# EAGLE schematic FDL-1 BSTP v1.0 (EAGLE 7.5.0)
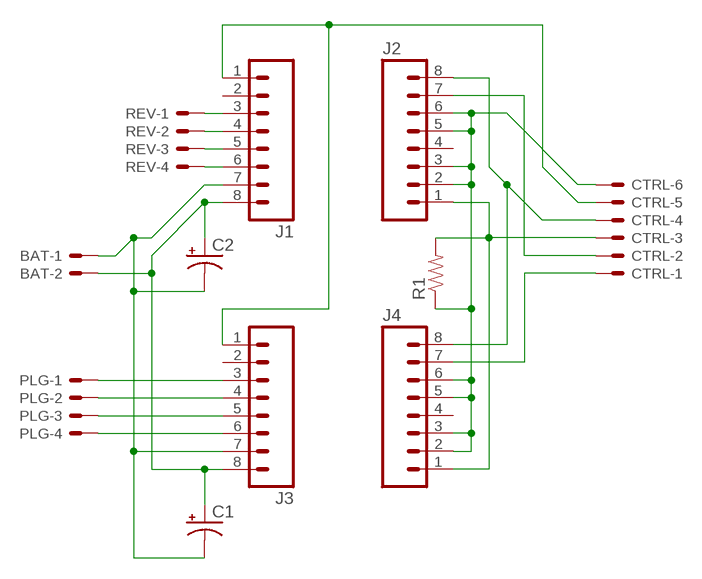
[diagram p0: schematic, sheet 1]

## Parts
BAT  JST-XH-02-PIN-LONG-PAD  [JST-XH-02-PACKAGE-LONG-PAD]
C1  CAP_POLPTH1  [CPOL-RADIAL-100UF-25V]
C2  CAP_POLPTH1  [CPOL-RADIAL-100UF-25V]
CTRL  JST-XH-06-PIN-LONG-PAD  [JST-XH-06-PACKAGE-LONG-PAD]
J1  M08SILK_FEMALE_PTH  [1X08]
J2  M08SILK_FEMALE_PTH  [1X08]
J3  M08SILK_FEMALE_PTH  [1X08]
J4  M08SILK_FEMALE_PTH  [1X08]
PLG  JST-XH-04-PIN-LONG-PAD  [JST-XH-04-PACKAGE-LONG-PAD]
R1  RESISTORPTH-1/4W  [AXIAL-0.4]
REV  JST-XH-04-PIN-LONG-PAD  [JST-XH-04-PACKAGE-LONG-PAD]

## Nets
N$1: J1.6 REV.4
N$2: J1.5 REV.3
N$3: J1.4 REV.2
N$4: J1.3 REV.1
N$5: J3.6 PLG.4
N$6: J3.5 PLG.3
N$7: J3.4 PLG.2
N$8: J3.3 PLG.1
N$10: BAT.2 C1.1(+) C2.1(+) J1.8 J3.8
N$11: CTRL.6 J2.2 J2.3 J2.5 J2.6 J4.2 J4.3 J4.5 J4.6 R1.P$1
N$12: CTRL.3 J2.1 J4.1 R1.P$2
N$13: CTRL.4 J2.8 J4.8
N$14: CTRL.5 J1.1 J3.1
N$15: CTRL.2 J2.7
N$16: CTRL.1 J4.7
N$17: BAT.1 C1.2(-) C2.2(-) J1.7 J3.7
Unconnected: J1.2 J2.4 J3.2 J4.4

## Library data of the parts
BAT = Rembrandt Electronics - JST XH Connectors v1-0:JST-XH-02-PIN: JST XH Connector 2 Pin Wire to board connector. Pitch: 2,54 mm, (0.100") Number of pins: 2 Created by Rembrandt Electronics www.rembrandtelectronics.com
C1 C2 = SparkFun-Capacitors:CAP_POL: Capacitor Polarized These are standard SMD and PTH capacitors. Normally 10uF, 47uF, and 100uF in electrolytic and tantalum varieties. Always verify the external diameter of the through hole cap, it varies with capacity, voltage, and manufacturer. The EIA devices should be standard.
CTRL = Rembrandt Electronics - JST XH Connectors v1-0:JST-XH-06-PIN: JST XH Connector 2 Pin Wire to board connector. Pitch: 2,54 mm, (0.100") Number of pins: 6 Created by Rembrandt Electronics www.rembrandtelectronics.com
J1-J4 = SparkFun-Connectors:M08: Header 8 Standard 8-pin 0.1" header. Use with straight break away headers (SKU : PRT-00116), right angle break away headers (PRT-00553), swiss pins (PRT-00743), machine pins (PRT-00117), and female headers (PRT-00115).; PROD_ID: CONN-08438
PLG REV = Rembrandt Electronics - JST XH Connectors v1-0:JST-XH-04-PIN: JST XH Connector 2 Pin Wire to board connector. Pitch: 2,54 mm, (0.100") Number of pins: 4 Created by Rembrandt Electronics www.rembrandtelectronics.com
R1 = SparkFun-Resistors:RESISTOR: Resistor Basic schematic elements and footprints for 0603, 1206, and PTH resistors.